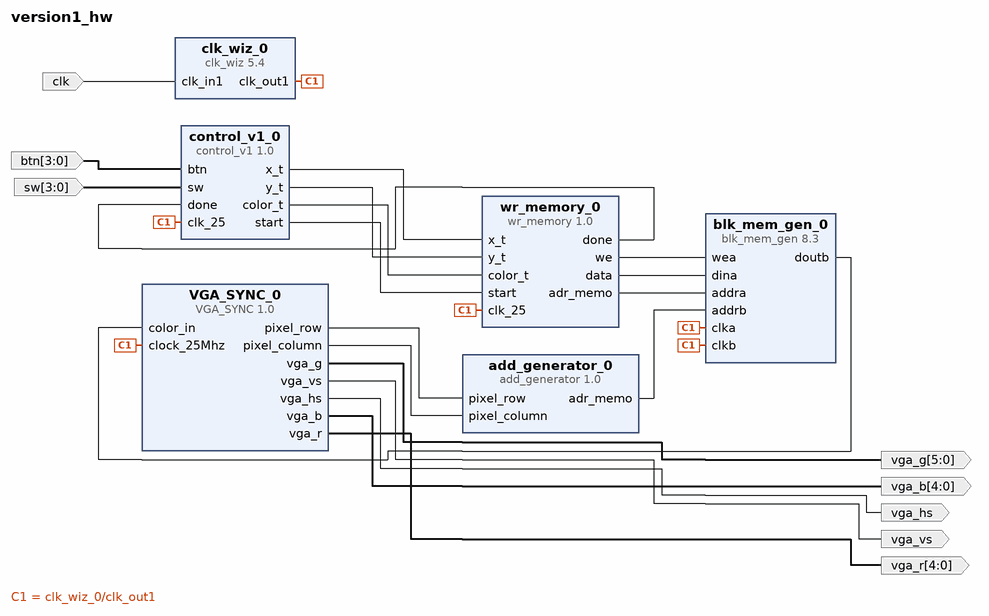
[diagram p0: block diagram of the top level]
# Vivado block design version1_hw, xc7z010clg400-1, Vivado 2017.2
create_bd_design version1_hw

create_bd_port -dir I -type clk clk
create_bd_port -dir I -from 3 -to 0 btn
create_bd_port -dir I -from 3 -to 0 sw
create_bd_port -dir O -from 5 -to 0 vga_g
create_bd_port -dir O vga_vs
create_bd_port -dir O vga_hs
create_bd_port -dir O -from 4 -to 0 vga_b
create_bd_port -dir O -from 4 -to 0 vga_r

create_bd_cell -type ip -vlnv xilinx.com:ip:blk_mem_gen:8.3 blk_mem_gen_0
set_property -dict [list \
  CONFIG.Memory_Type Simple_Dual_Port_RAM \
  CONFIG.Enable_32bit_Address false \
  CONFIG.Use_Byte_Write_Enable false \
  CONFIG.Assume_Synchronous_Clk true \
  CONFIG.Write_Width_A 3 \
  CONFIG.Write_Depth_A 131072 \
  CONFIG.Operating_Mode_A NO_CHANGE \
  CONFIG.Enable_A Always_Enabled \
  CONFIG.Write_Width_B 3 \
  CONFIG.Read_Width_B 3 \
  CONFIG.Enable_B Always_Enabled \
  CONFIG.Register_PortB_Output_of_Memory_Primitives true \
  CONFIG.Fill_Remaining_Memory_Locations true \
  CONFIG.Port_B_Clock 100 \
  CONFIG.Port_B_Enable_Rate 100 \
  CONFIG.use_bram_block Stand_Alone \
] [get_bd_cells blk_mem_gen_0]
create_bd_cell -type ip -vlnv xilinx.com:ip:clk_wiz:5.4 clk_wiz_0
set_property -dict [list \
  CONFIG.CLKIN1_JITTER_PS 80.0 \
  CONFIG.CLKOUT1_REQUESTED_OUT_FREQ 25.000 \
  CONFIG.MMCM_DIVCLK_DIVIDE 5 \
  CONFIG.MMCM_CLKFBOUT_MULT_F 36.500 \
  CONFIG.MMCM_CLKIN1_PERIOD 8.000 \
  CONFIG.MMCM_CLKOUT0_DIVIDE_F 36.500 \
  CONFIG.USE_BOARD_FLOW true \
  CONFIG.CLK_IN1_BOARD_INTERFACE sys_clock \
  CONFIG.CLKOUT1_JITTER 312.659 \
  CONFIG.CLKOUT1_PHASE_ERROR 245.713 \
] [get_bd_cells clk_wiz_0]
create_bd_cell -type ip -vlnv user.org:user:add_generator:1.0 add_generator_0
create_bd_cell -type ip -vlnv user.org:user:control_v1:1.0 control_v1_0
create_bd_cell -type ip -vlnv user.org:user:VGA_SYNC:1.0 VGA_SYNC_0
create_bd_cell -type ip -vlnv user.org:user:wr_memory:1.0 wr_memory_0

# ---- connections ----

connect_bd_net -net clk_in1_1 [get_bd_ports clk] [get_bd_pins clk_wiz_0/clk_in1]
connect_bd_net [get_bd_ports btn] [get_bd_pins control_v1_0/btn]
connect_bd_net [get_bd_ports sw] [get_bd_pins control_v1_0/sw]
connect_bd_net [get_bd_pins clk_wiz_0/clk_out1] \
  [get_bd_pins wr_memory_0/clk_25] [get_bd_pins VGA_SYNC_0/clock_25Mhz] [get_bd_pins blk_mem_gen_0/clka] \
  [get_bd_pins blk_mem_gen_0/clkb] [get_bd_pins control_v1_0/clk_25]
connect_bd_net [get_bd_pins wr_memory_0/done] [get_bd_pins control_v1_0/done]
connect_bd_net [get_bd_pins control_v1_0/x_t] [get_bd_pins wr_memory_0/x_t]
connect_bd_net [get_bd_pins control_v1_0/y_t] [get_bd_pins wr_memory_0/y_t]
connect_bd_net [get_bd_pins control_v1_0/color_t] [get_bd_pins wr_memory_0/color_t]
connect_bd_net [get_bd_pins control_v1_0/start] [get_bd_pins wr_memory_0/start]
connect_bd_net [get_bd_pins wr_memory_0/we] [get_bd_pins blk_mem_gen_0/wea]
connect_bd_net [get_bd_pins wr_memory_0/data] [get_bd_pins blk_mem_gen_0/dina]
connect_bd_net [get_bd_pins wr_memory_0/adr_memo] [get_bd_pins blk_mem_gen_0/addra]
connect_bd_net [get_bd_pins add_generator_0/adr_memo] [get_bd_pins blk_mem_gen_0/addrb]
connect_bd_net [get_bd_pins VGA_SYNC_0/pixel_row] [get_bd_pins add_generator_0/pixel_row]
connect_bd_net [get_bd_pins VGA_SYNC_0/pixel_column] [get_bd_pins add_generator_0/pixel_column]
connect_bd_net [get_bd_pins VGA_SYNC_0/vga_g] [get_bd_ports vga_g]
connect_bd_net [get_bd_pins VGA_SYNC_0/vga_vs] [get_bd_ports vga_vs]
connect_bd_net [get_bd_pins VGA_SYNC_0/vga_hs] [get_bd_ports vga_hs]
connect_bd_net [get_bd_pins VGA_SYNC_0/vga_b] [get_bd_ports vga_b]
connect_bd_net [get_bd_pins VGA_SYNC_0/vga_r] [get_bd_ports vga_r]
connect_bd_net [get_bd_pins blk_mem_gen_0/doutb] [get_bd_pins VGA_SYNC_0/color_in]

validate_bd_design
save_bd_design
